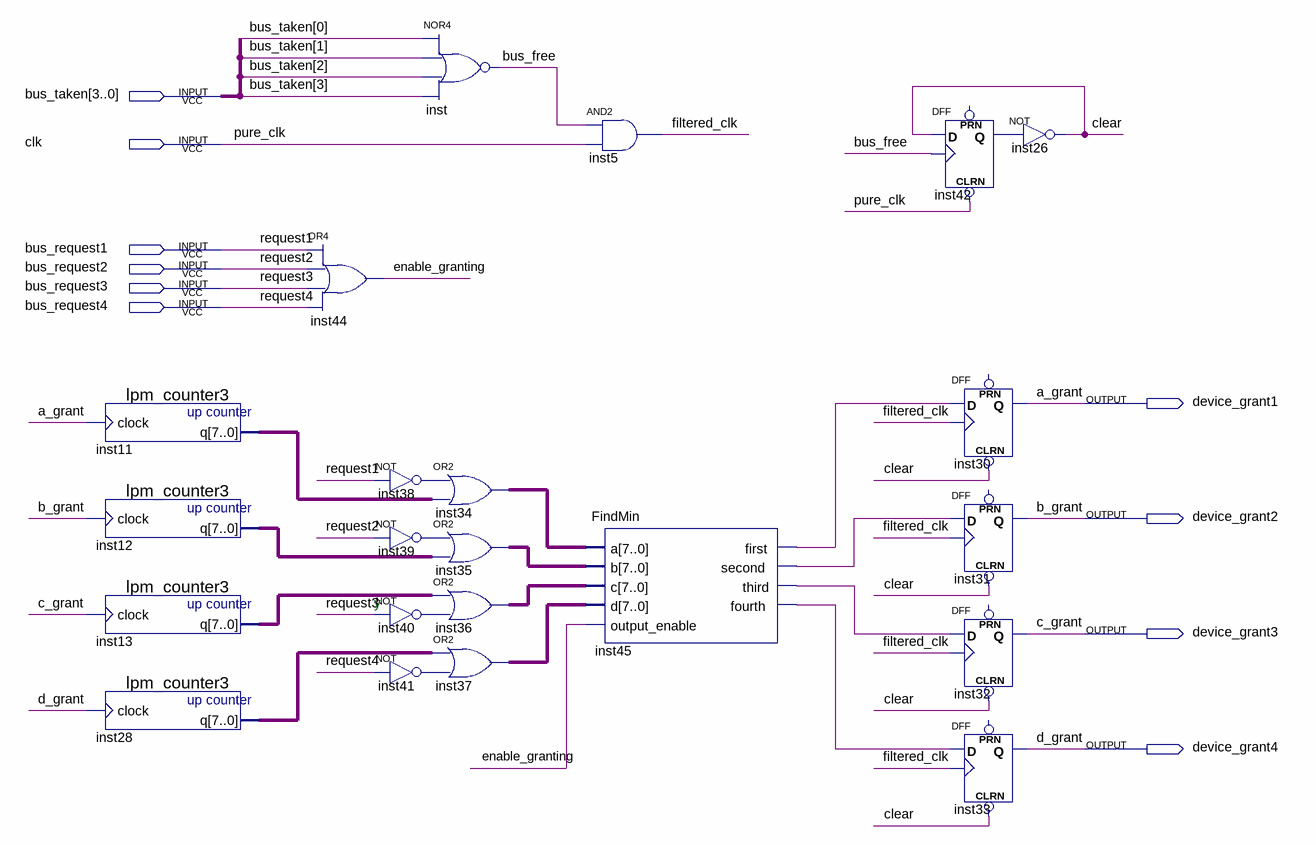
[diagram p0: schematic sheet]
// Quartus schematic ArbiterDevice.bdf as structural Verilog: 22 symbols, 10 pins
module ArbiterDevice (
  input  [3:0] bus_taken,
  input  clk,
  input  bus_request1,
  input  bus_request2,
  input  bus_request3,
  input  bus_request4,
  output device_grant1,
  output device_grant2,
  output device_grant3,
  output device_grant4
);

  wire bus_free, clear, enable_granting, filtered_clk, inst38_out, inst39_out, inst40_out, inst41_out,
       inst42_q, inst45_first, inst45_fourth, inst45_second, inst45_third;
  wire [7:0] inst11_q, inst12_q, inst13_q, inst28_q, inst34_out, inst35_out, inst36_out, inst37_out;

  lpm_counter3 inst11 (.clock(device_grant1), .q(inst11_q));
  lpm_counter3 inst12 (.clock(device_grant2), .q(inst12_q));
  lpm_counter3 inst13 (.clock(device_grant3), .q(inst13_q));
  lpm_counter3 inst28 (.clock(device_grant4), .q(inst28_q));
  or inst44 (enable_granting, bus_request1, bus_request2, bus_request3, bus_request4);
  nor inst (bus_free, bus_taken[0], bus_taken[1], bus_taken[2], bus_taken[3]);
  not inst38 (inst38_out, bus_request1);
  not inst39 (inst39_out, bus_request2);
  not inst40 (inst40_out, bus_request3);
  not inst41 (inst41_out, bus_request4);
  assign inst34_out = {8{inst38_out}} | inst11_q;  // OR2 inst34, 8 bits wide
  assign inst35_out = {8{inst39_out}} | inst12_q;  // OR2 inst35, 8 bits wide
  assign inst36_out = inst13_q | {8{inst40_out}};  // OR2 inst36, 8 bits wide
  assign inst37_out = inst28_q | {8{inst41_out}};  // OR2 inst37, 8 bits wide
  and inst5 (filtered_clk, bus_free, clk);
  FindMin inst45 (
    .a(inst34_out), .b(inst35_out), .c(inst36_out), .d(inst37_out), .output_enable(enable_granting),
    .first(inst45_first), .second(inst45_second), .third(inst45_third), .fourth(inst45_fourth));
  DFF inst42 (.CLRN(clk), .CLK(bus_free), .D(clear), .Q(inst42_q));  // open: PRN
  DFF inst30 (.CLRN(clear), .CLK(filtered_clk), .D(inst45_first), .Q(device_grant1));  // open: PRN
  DFF inst31 (.CLRN(clear), .CLK(filtered_clk), .D(inst45_second), .Q(device_grant2));  // open: PRN
  DFF inst32 (.CLRN(clear), .CLK(filtered_clk), .D(inst45_third), .Q(device_grant3));  // open: PRN
  DFF inst33 (.CLRN(clear), .CLK(filtered_clk), .D(inst45_fourth), .Q(device_grant4));  // open: PRN
  not inst26 (clear, inst42_q);

  // Other names for the same wires on the sheet: a_grant = device_grant1; b_grant = device_grant2;
  //   c_grant = device_grant3; d_grant = device_grant4; pure_clk = clk; request1 = bus_request1;
  //   request2 = bus_request2; request3 = bus_request3; request4 = bus_request4

  // Notes on the sheet:
  //   y
endmodule
